# EAGLE schematic radio_schematic (EAGLE 9.6.2)
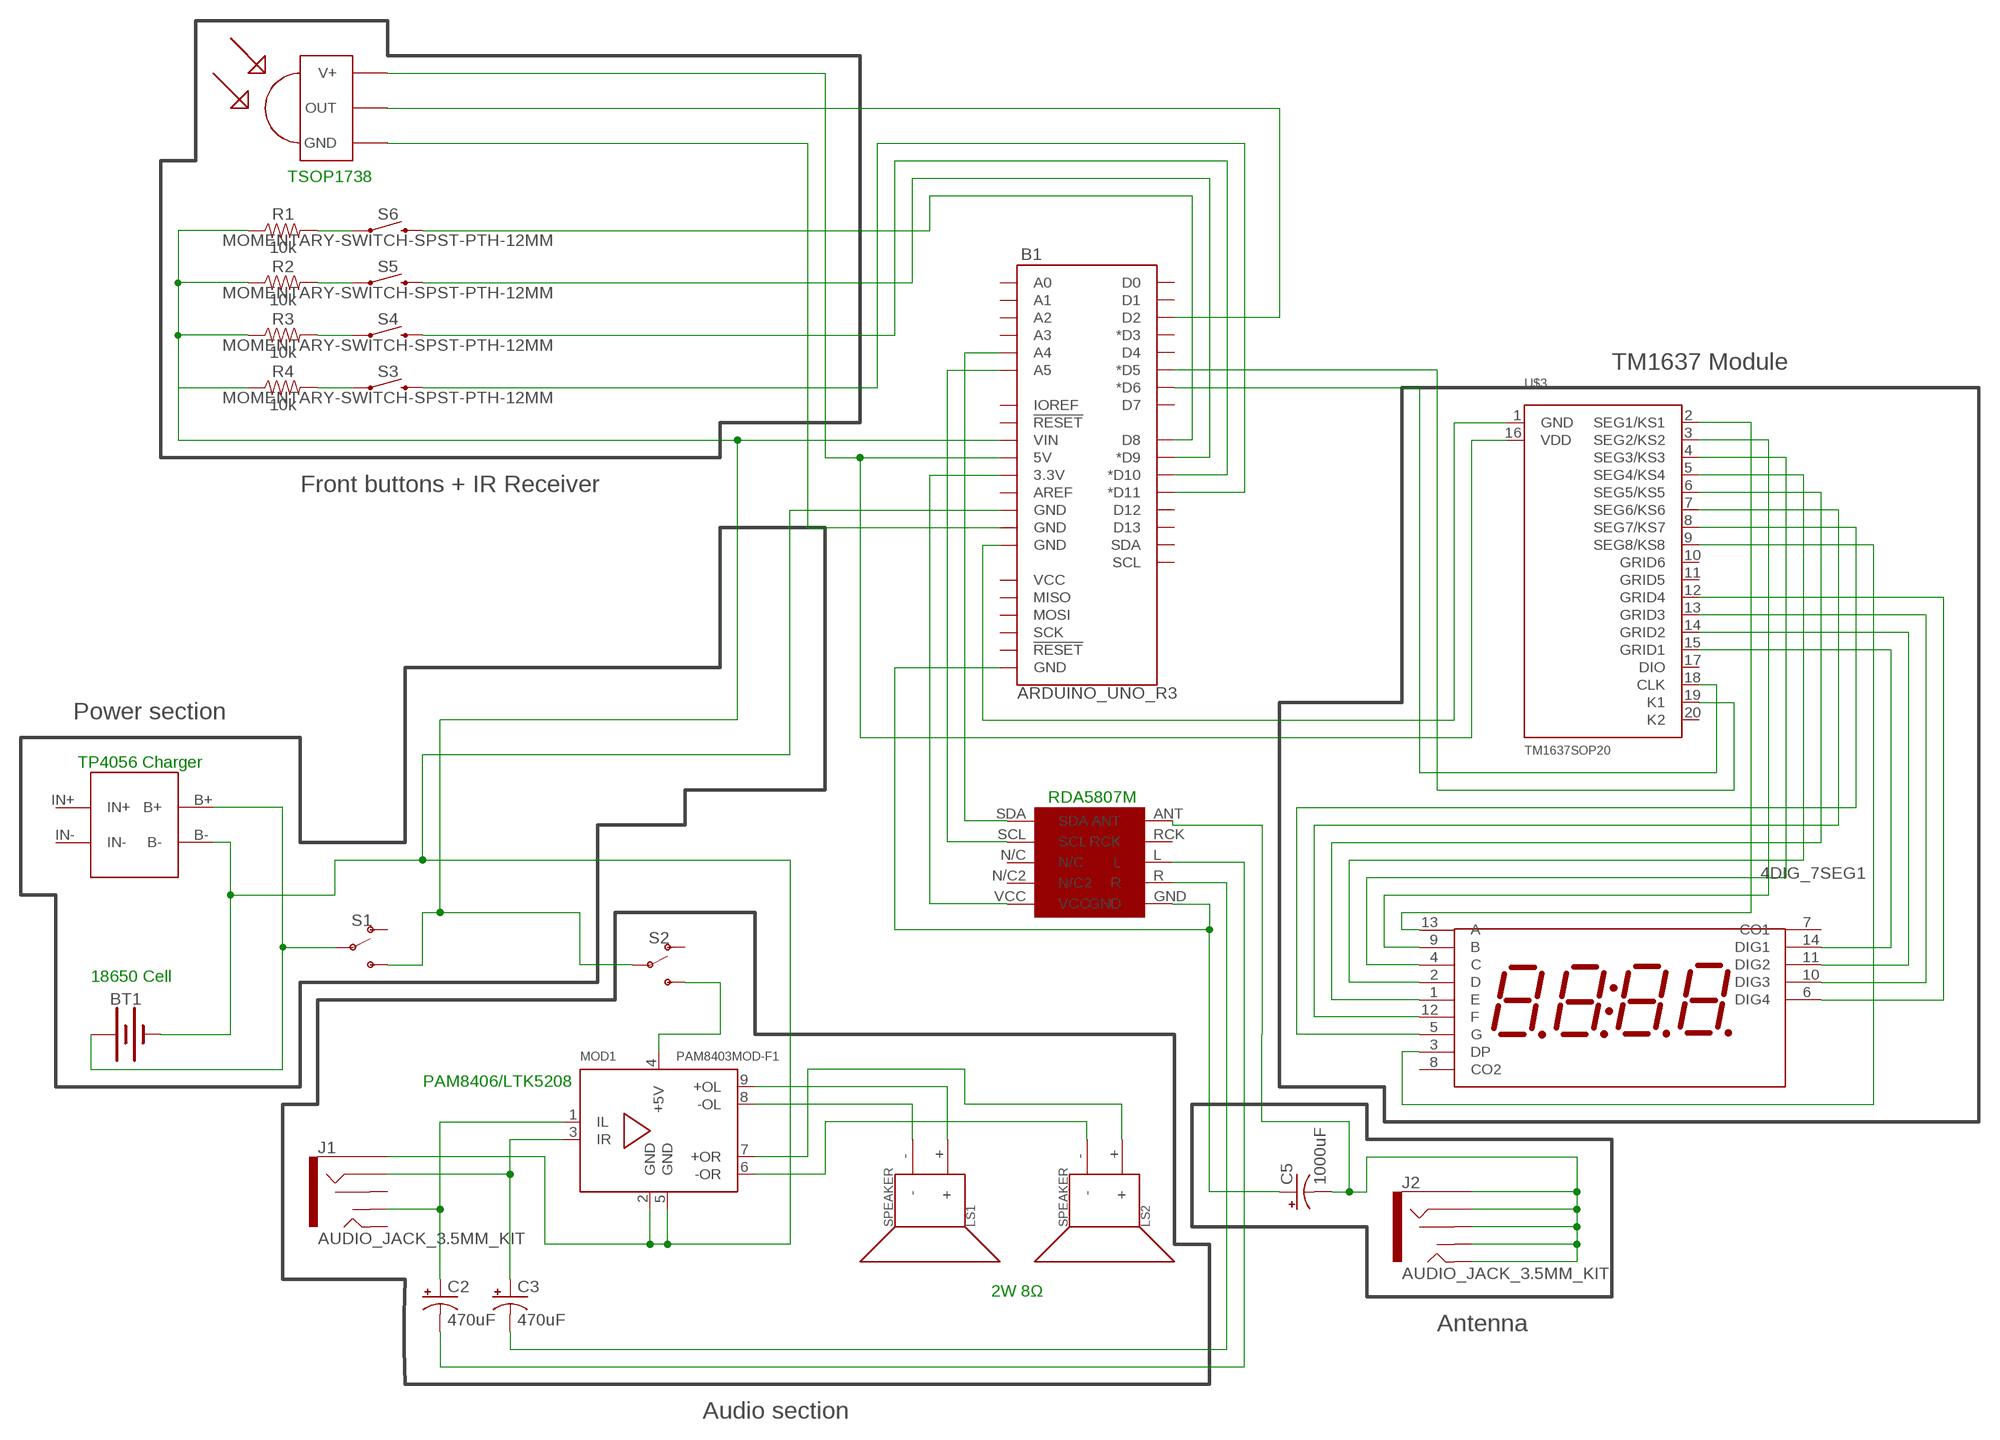
[diagram p0: schematic, sheet 1]

## Parts
4DIG_7SEG1  4DIG_7SEG  [4DIG_7SEG]
B1  ARDUINO_UNO_R3  [ARDUINO_R3]
BT1  BATTERY-18650  [BATTERY_18650-HOLDER]
C2  470uF  100UF-POLAR-RADIAL-2.5MM-25V-20%  [CPOL-RADIAL-2.5MM-6.5MM]
C3  470uF  100UF-POLAR-RADIAL-2.5MM-25V-20%  [CPOL-RADIAL-2.5MM-6.5MM]
C5  1000uF  100UF-POLAR-RADIAL-2.5MM-25V-20%  [CPOL-RADIAL-2.5MM-6.5MM]
J1  AUDIO_JACK_3.5MM_KIT  [AUDIO-JACK-KIT]
J2  AUDIO_JACK_3.5MM_KIT  [AUDIO-JACK-KIT]
LS1  SPEAKER  [PCB_MOUNT_SPEAKER]
LS2  SPEAKER  [PCB_MOUNT_SPEAKER]
MOD1  PAM8403MOD-F1  [PAM8403MOD1]
R1  10k  10KOHM-HORIZ-1/4W-5%  [AXIAL-0.3]
R2  10k  10KOHM-HORIZ-1/4W-5%  [AXIAL-0.3]
R3  10k  10KOHM-HORIZ-1/4W-5%  [AXIAL-0.3]
R4  10k  10KOHM-HORIZ-1/4W-5%  [AXIAL-0.3]
S1  SWITCH-SPDT-PTH-11.6X4.0MM-SHORT_LEADS  [SWITCH_SPDT_PTH_11.6X4.0MM]
S2  SWITCH-SPDT-PTH-11.6X4.0MM-SHORT_LEADS  [SWITCH_SPDT_PTH_11.6X4.0MM]
S3  MOMENTARY-SWITCH-SPST-PTH-12MM  [TACTILE_SWITCH_PTH_12MM]
S4  MOMENTARY-SWITCH-SPST-PTH-12MM  [TACTILE_SWITCH_PTH_12MM]
S5  MOMENTARY-SWITCH-SPST-PTH-12MM  [TACTILE_SWITCH_PTH_12MM]
S6  MOMENTARY-SWITCH-SPST-PTH-12MM  [TACTILE_SWITCH_PTH_12MM]
U$1  RDA  [RDA]
U$2  TSOP1738  [TSOP17XX]
U$3  TM1637SOP20  [SOP20]
U$4  TP4056  [TP4056]

## Nets
GND: B1.GND@1(GND) C5.1(+) U$1.GND
N$1: 4DIG_7SEG1.13(A) U$3.2(SEG1/KS1)
N$2: 4DIG_7SEG1.9(B) U$3.3(SEG2/KS2)
N$3: 4DIG_7SEG1.4(C) U$3.4(SEG3/KS3)
N$4: 4DIG_7SEG1.2(D) U$3.5(SEG4/KS4)
N$5: 4DIG_7SEG1.1(E) U$3.6(SEG5/KS5)
N$6: 4DIG_7SEG1.12(F) U$3.7(SEG6/KS6)
N$7: 4DIG_7SEG1.5(G) U$3.8(SEG7/KS7)
N$8: 4DIG_7SEG1.3(DP) U$3.9(SEG8/KS8)
N$9: C5.2(-) J2.RING J2.RSH J2.SLEEVE J2.TIP J2.TSH U$1.ANT
N$10: 4DIG_7SEG1.14(DIG1) U$3.15(GRID1)
N$11: 4DIG_7SEG1.11(DIG2) U$3.14(GRID2)
N$12: 4DIG_7SEG1.10(DIG3) U$3.13(GRID3)
N$13: B1.A4 U$1.SDA
N$15: B1.D5(*D5) U$3.19(K1)
N$16: BT1.PWR@1(+) S1.2(P) U$4.B+
N$18: MOD1.4(+5V) S2.3(S)
N$19: B1.5V U$2.V+ U$3.16(VDD)
N$20: B1.GND@4(GND) BT1.GND@1(-) J1.SLEEVE MOD1.2(GND) MOD1.5(GND) U$4.B-
N$21: B1.D6(*D6) U$3.18(CLK)
N$22: B1.A5 U$1.SCL
N$23: B1.3.3V U$1.VCC
N$24: C2.1(+) J1.TSH MOD1.1(IL)
N$25: C3.1(+) J1.RING MOD1.3(IR)
N$26: C3.2(-) U$1.R
N$27: C2.2(-) U$1.L
N$28: LS1.- MOD1.8(-OL)
N$29: LS1.+ MOD1.9(+OL)
N$30: LS2.- MOD1.6(-OR)
N$31: LS2.+ MOD1.7(+OR)
N$32: B1.D8 S6.3
N$33: B1.D9(*D9) S5.3
N$34: B1.D10(*D10) S4.3
N$35: B1.D11(*D11) S3.3
N$36: R1.P$2 S6.1
N$37: R2.P$2 S5.1
N$38: R3.P$2 S4.1
N$39: R4.P$2 S3.1
N$41: B1.D2 U$2.OUT
N$42: B1.GND@3(GND) U$2.GND
N$43: B1.VIN R1.P$1 R2.P$1 R3.P$1 R4.P$1 S1.3(S) S2.2(P)
N$44: 4DIG_7SEG1.6(DIG4) U$3.12(GRID4)
N$47: B1.GND@2(GND) U$3.1(GND)
Unconnected: 4DIG_7SEG1.7(CO1) 4DIG_7SEG1.8(CO2) B1.A0 B1.A1 B1.A2 B1.A3 B1.AREF B1.D0 B1.D1 B1.D3(*D3) B1.D4 B1.D7 B1.D12 B1.D13 B1.IOREF B1.MISO B1.MOSI B1.RESET@1(!RESET!) B1.RESET@2(!RESET!) B1.SCK B1.SCL B1.SDA B1.VCC J1.RSH J1.TIP S1.1(O) S2.1(O) U$1.N/C U$1.N/C2 U$1.RCK U$3.10(GRID6) U$3.11(GRID5) U$3.17(DIO) U$3.20(K2) U$4.IN+ U$4.IN-

## Notes on the sheet
- TSOP1738
- TM1637 Module
- Front buttons + IR Receiver
- Power section
- TP4056 Charger
- RDA5807M
- 18650 Cell
- PAM8406/LTK5208
- 2W 8Ω
- Antenna
- Audio section

## Library data of the parts
4DIG_7SEG1 = 7-seg-disp:4DIG_7SEG: This library is modified to the Adafruit 4dig7seg display, part# KW4-56NCBA-P. It doesn't have the up decimal, and the pins are reassigned. This is common cathode. This library was based on BL-Q39A42 respectively BL-Q39B42 display but support many others displays where PAD/PIN assign is same.Display may be common cathode or common anode because PAD/PIN assign is still the same. PIN DESCRIPTION: DIG1-DIG4 : common cathode or common anode of digit CO1-CO2: cathode or anode of colon (Depends on the display), DIG1-DIG4: common cathodes or anodes of digits, A - G+ DP: cathodes or anodes of segments A to F with dot point . Made by: www.developrog.com, modified by Kiki Jewell 2016
B1 = SparkFun-Boards:ARDUINO_UNO_R3: Arduino R3 Footprint with SPI header Arduino Uno R3 Compatible Footprint. Matches PCB size of the original board. SparkFun Products: SAMD21 Dev Breakout <https://www.sparkfun.com/products/13672> RedBoard <https://www.sparkfun.com/products/12757> R3 Stackable Headers <https://www.sparkfun.com/products/11417>
BT1 = SparkFun-Batteries:BATTERY: Battery - Single Cell A variety of battery chemistries, sizes, and footprints. Device List: 20MM_PTH - Coin Cell Battery Holder - 20mm (PTH) <https://www.sparkfun.com/products/783> 20MM_PTH_KIT- Coin Cell battery Holder - 20 mm (PTH) <http://www.sparkfun.com/products/783>kit version with special mask 6.8MM_PTH - Coin Cell Battery Holder - 6.8MM(SMD) <https://www.digikey.com/product-detail/en/seiko-instruments/MS621FE-FL11E/728-1057-ND/1889208?WT.srch=1&gclid=CNOQ5a6LzdQCFZS2wAodXCkE0g> 12MM_SMD - Coin Cell Battery Holder - 12mm (SMD) <https://www.sparkfun.com/products/10592> 12MM_PTH - Coin Cell Battery Holder - 12mm (PTH) <https://www.sparkfun.com/products/7948> 20MM_SMD - 20mm Coin Cell Battery Holder (SMD) (2 legs) Used on the Big Time Watch Kit <https://www.sparkfun.com/products/11734> 20MM_SMD_4LEGS - Coin Cell Battery Holder - 20mm (SMD) <https://www.sparkfun.com/products/11892> 20MM_SMD_4LEGS_OVERPASTE - Coin Cell Battery Holder - 20mm (SMD) <https://www.sparkfun.com/products/11892> (Over-paste on the legs) 24.5MM_PTH - Coin Cell Battery Holder - 24.5mm (PTH) <https://www.sparkfun.com/products/8863> 9V - 9V Battery Holder - PC Mount Used on the SparkFun SparkPunk Sound Kit <https://www.sparkfun.com/products/11177> and SparkFun SparkPunk Sequencer Kit <https://www.sparkfun.com/products/12707> 18650 - Battery Holder - 18650 (PTH) <https://www.sparkfun.com/products/13113> AA - Battery Holder - 1xAA (PTH) <https://www.sparkfun.com/products/7949> AAA - Battery Holder - 1xAAA (PTH) <https://www.sparkfun.com/products/12718> AA_KIT - Battery Holder - 1xAA (PTH) <https://www.sparkfun.com/products/7949> Special kit package - pads only have exposed copper on one side of the board. AAA_KIT - Battery Holder - 1xAAA (PTH) <https://www.sparkfun.com/products/12718> Special kit package - pads only have exposed copper on one side of the board.; PROD_ID: BATT-12327; SF_SKU: PRT-13113
C2 C3 C5 = SparkFun-Capacitors:100UF-POLAR: 100µF polarized capacitors A capacitor is a passive two-terminal electrical component used to store electrical energy temporarily in an electric field.; PROD_ID: CAP-08439; VALUE: 100uF
J1 J2 = SparkFun-Connectors:AUDIO_JACK_3.5MM: Audio Jack 3.5mm variants of PTH and SMT stereo audio jack with bypass switches. SparkFun Products: SparkFun SparkPunk Sound Kit <[https://www.sparkfun.com/products/11177]> - PTH MP3 Trigger <https://www.sparkfun.com/products/13720> -3.5mm SMD SparkFun PicoBoard <https://www.sparkfun.com/products/11888>- 2.5mm SMD; PROD_ID: CONN-08774; SF_ID: PRT-08032
LS1 LS2 = SparkFun-Electromechanical:SPEAKER: Speaker Generic 2-terminal loudspeakers SparkFun Products Speaker - PCB Mount <https://www.sparkfun.com/products/11089> (COM-11089); PROD_ID: COMP-11789; SF_SKU: COM-11089
MOD1 = dl9sec_public:PAM8403MOD: PAM8403 module 2x3W@4R
R1-R4 = SparkFun-Resistors:10KOHM: 10kΩ resistor A resistor is a passive two-terminal electrical component that implements electrical resistance as a circuit element. Resistors act to reduce current flow, and, at the same time, act to lower voltage levels within circuits. - Wikipedia; PROD_ID: RES-09435
S1 S2 = SparkFun-Switches:SWITCH-SPDT: Single Pole, Double Throw (SPDT) Switch Single-pole, double-throw (SPDT) switch. Variant Overview SMD-AYZ0202 Surface Mount DPDT Switch <https://www.sparkfun.com/products/597> (COM-00597) Used on e.g. LilyPad Arduino USB - ATmega32U4 Board <https://www.sparkfun.com/products/12049> PTH-11.6X4.0MM SPDT Mini Power Switch <https://www.sparkfun.com/products/102> (COM-00102) Used on e.g. SparkFun Simon Says - Through-Hole Soldering Kit <https://www.sparkfun.com/products/10547> (KIT-10547) PTH-11.6X4.0MM-KIT KIT version of SPDT Mini Power Switch - Simplifies soldering by removing tStop of switch pins - only one side can be soldered. PTH-11.6X4.0MM-LOCK LOCK version of SPDT Mini Power Switch - Offset pins hold switch in place for easier soldering. SMD-RIGHT-ANGLE Surface Mount Right Angle Switch <https://www.sparkfun.com/products/10860> (COM-10860) Used on e.g. SparkFun ESP8266 Thing <https://www.sparkfun.com/products/13231>; PROD_ID: SWCH-13151
S3-S6 = SparkFun-Switches:MOMENTARY-SWITCH-SPST: Momentary Switch (Pushbutton) - SPST Normally-open (NO) SPST momentary switches (buttons, pushbuttons). Variants PTH-12MM - 12mm square, through-hole Momentary Pushbutton Switch - 12mm Square <https://www.sparkfun.com/products/9190> (COM-09190) PTH-6.0MM, PTH-6.0MM-KIT - 6.0mm square, through-hole Mini Pushbutton Switch <https://www.sparkfun.com/products/97> (COM-00097) KIT package intended for soldering kit's - only one side of pads' copper is exposed. PTH-RIGHT-ANGLE-KIT - Right-angle, through-hole Right Angle Tactile Button <https://www.sparkfun.com/products/10791> - Used on SparkFun BigTime Watch Kit <https://www.sparkfun.com/products/11734> SMD-12MM - 12mm square, surface-mount Tactile Button - SMD (12mm) <https://www.sparkfun.com/products/12993> (COM-12993) Used on SparkFun PicoBoard <https://www.sparkfun.com/products/11888> SMD-4.5MM - 4.5mm Square Trackball Switch Used on SparkFun Blackberry Trackballer Breakout <https://www.sparkfun.com/products/13169> SMD-4.6MMX2.8MM - 4.60mm x 2.80mm, surface mount Used on SparkFun Pro Micro - RP2040 <https://www.sparkfun.com/products/17717> SMD-5.2MM, SMD-5.2-REDUNDANT - 5.2mm square, surface-mount Mini Pushbutton Switch - SMD <https://www.sparkfun.com/products/8720> (COM-08720) Used on Arduino Pro Mini <https://www.sparkfun.com/products/11114> REDUNDANT package connects both switch circuits together SMD-6.0X3.5MM - 6.0 x 3.5mm, surface mount Momentary Reset Switch SMD <https://www.sparkfun.com/products/8229> (COM-08229) SMD-6.2MM-TALL - 6.2mm square, surface mount Tactile Button - SMD (6mm) <https://www.sparkfun.com/products/12992> Used on SparkFun Digital Sandbox <https://www.sparkfun.com/products/12651> SMD-RIGHT-ANGLE - Right-angle, surface mount Used on SparkFun Block for Intel® Edison - Arduino <https://www.sparkfun.com/products/13036>; PROD_ID: SWCH-09185; SF_SKU: COM-09190
U$1 = RDA:RDA
U$2 = tsop:TSOP1738: IR Receiver and Demodulator
U$3 = tm1637:TM1637
U$4 = 32teeth - TP4056 Module-noboost:TP4056